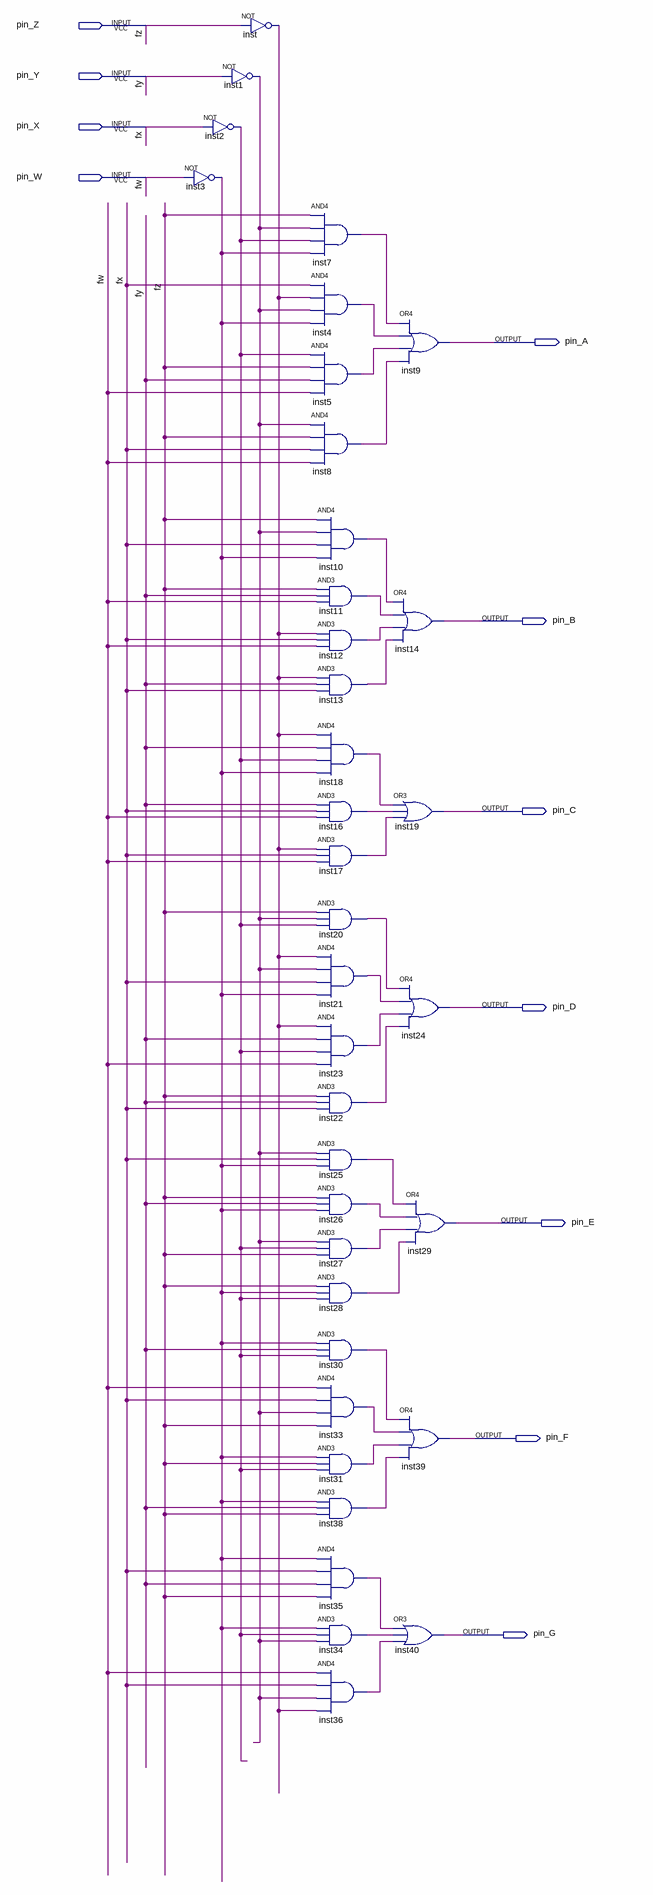
[diagram p0: schematic sheet]
// Quartus schematic aula04.bdf as structural Verilog: 37 symbols, 11 pins
module aula04 (
  input  pin_Z,
  input  pin_Y,
  input  pin_X,
  input  pin_W,
  output pin_A,
  output pin_B,
  output pin_C,
  output pin_D,
  output pin_E,
  output pin_F,
  output pin_G
);

  wire inst1_out, inst2_out, inst3_out, inst4_out, inst5_out, inst7_out, inst8_out, inst10_out, inst11_out,
       inst12_out, inst13_out, inst16_out, inst17_out, inst18_out, inst20_out, inst21_out, inst22_out,
       inst23_out, inst25_out, inst26_out, inst27_out, inst28_out, inst30_out, inst31_out, inst33_out,
       inst34_out, inst35_out, inst36_out, inst38_out, inst_out;

  not inst3 (inst3_out, pin_W);
  not inst (inst_out, pin_Z);
  not inst1 (inst1_out, pin_Y);
  not inst2 (inst2_out, pin_X);
  and inst7 (inst7_out, pin_Z, inst1_out, inst2_out, inst3_out);
  and inst4 (inst4_out, pin_X, inst_out, inst1_out, inst3_out);
  and inst5 (inst5_out, inst2_out, pin_Z, pin_Y, pin_W);
  and inst8 (inst8_out, inst1_out, pin_Z, pin_X, pin_W);
  and inst10 (inst10_out, pin_Z, inst1_out, pin_X, inst3_out);
  and inst11 (inst11_out, pin_Z, pin_Y, pin_W);
  and inst12 (inst12_out, inst_out, pin_X, pin_W);
  and inst13 (inst13_out, inst_out, pin_Y, pin_X);
  and inst18 (inst18_out, inst_out, pin_Y, inst2_out, inst3_out);
  and inst16 (inst16_out, pin_Y, pin_X, pin_W);
  and inst17 (inst17_out, inst_out, pin_X, pin_W);
  and inst20 (inst20_out, pin_Z, inst1_out, inst2_out);
  and inst21 (inst21_out, inst_out, inst1_out, pin_X, inst3_out);
  and inst23 (inst23_out, inst_out, pin_Y, inst2_out, pin_W);
  and inst22 (inst22_out, pin_Z, pin_Y, pin_X);
  and inst25 (inst25_out, inst1_out, pin_X, inst3_out);
  and inst26 (inst26_out, pin_Z, pin_Y, inst3_out);
  and inst27 (inst27_out, inst1_out, inst2_out, pin_Z);
  and inst28 (inst28_out, pin_Z, inst3_out, inst2_out);
  and inst30 (inst30_out, inst3_out, pin_Y, inst2_out);
  and inst33 (inst33_out, pin_W, pin_X, inst1_out, pin_Z);
  and inst31 (inst31_out, inst3_out, pin_Z, inst2_out);
  and inst38 (inst38_out, inst3_out, pin_Y, pin_Z);
  and inst35 (inst35_out, inst3_out, pin_X, pin_Y, pin_Z);
  and inst34 (inst34_out, inst3_out, inst2_out, inst1_out);
  and inst36 (inst36_out, pin_W, pin_X, inst1_out, inst_out);
  or inst9 (pin_A, inst7_out, inst4_out, inst5_out, inst8_out);
  or inst14 (pin_B, inst10_out, inst11_out, inst12_out, inst13_out);
  or inst19 (pin_C, inst18_out, inst16_out, inst17_out);
  or inst24 (pin_D, inst20_out, inst21_out, inst23_out, inst22_out);
  or inst39 (pin_F, inst30_out, inst33_out, inst31_out, inst38_out);
  or inst40 (pin_G, inst35_out, inst34_out, inst36_out);
  or inst29 (pin_E, inst25_out, inst26_out, inst27_out, inst28_out);

  // Other names for the same wires on the sheet: fw = pin_W; fx = pin_X; fy = pin_Y; fz = pin_Z
endmodule
